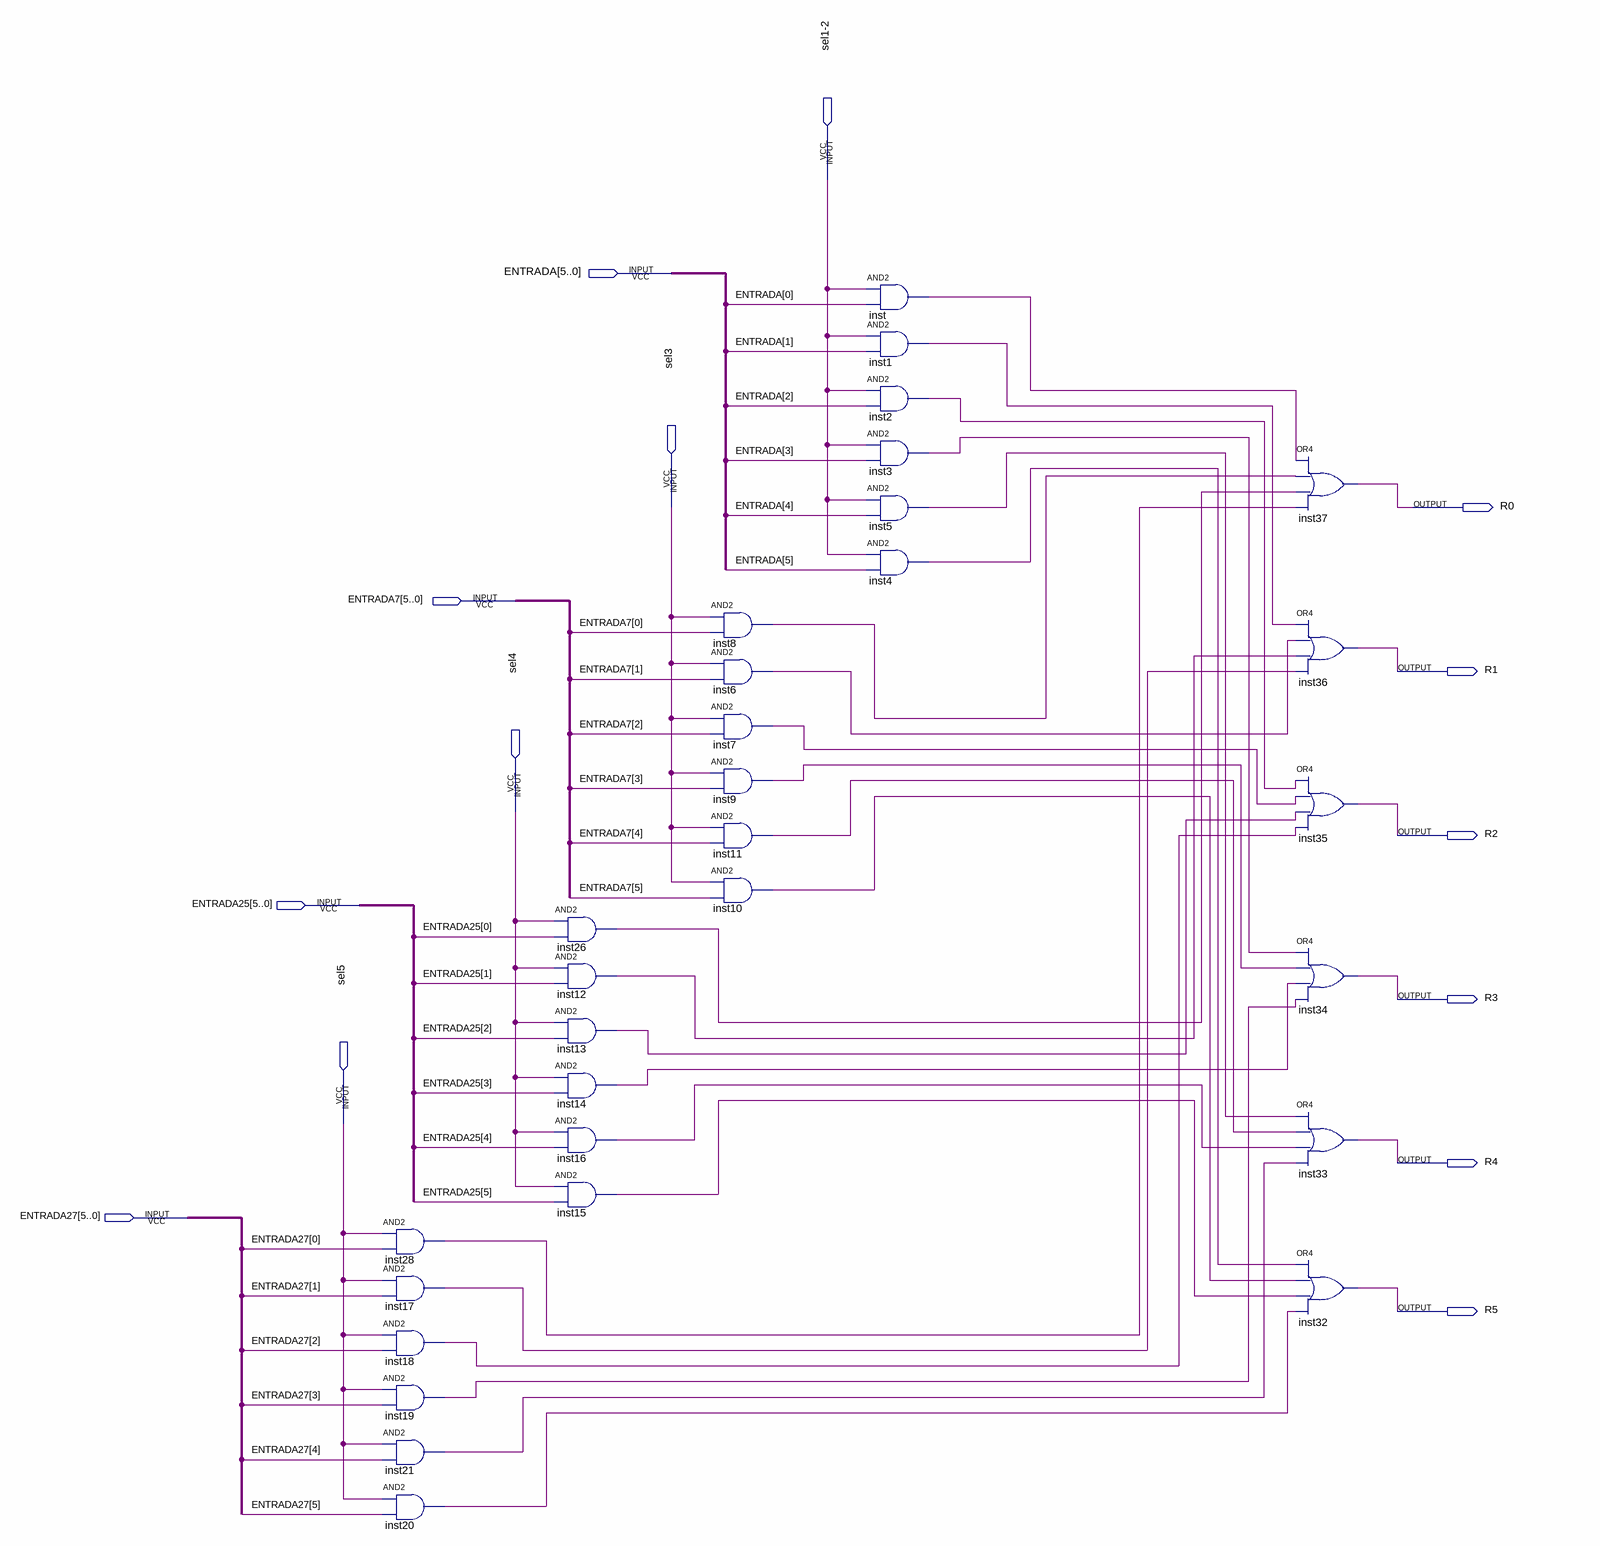
[diagram p0: schematic sheet]
// Quartus schematic OrEntrada.bdf as structural Verilog: 30 symbols, 14 pins
module OrEntrada (
  input  \sel1-2 ,
  input  [5:0] ENTRADA,
  input  sel3,
  input  [5:0] ENTRADA7,
  input  sel4,
  input  [5:0] ENTRADA25,
  input  sel5,
  input  [5:0] ENTRADA27,
  output R0,
  output R1,
  output R2,
  output R3,
  output R4,
  output R5
);

  wire inst1_out, inst2_out, inst3_out, inst4_out, inst5_out, inst6_out, inst7_out, inst8_out, inst9_out,
       inst10_out, inst11_out, inst12_out, inst13_out, inst14_out, inst15_out, inst16_out, inst17_out,
       inst18_out, inst19_out, inst20_out, inst21_out, inst26_out, inst28_out, inst_out;

  and inst28 (inst28_out, sel5, ENTRADA27[0]);
  and inst17 (inst17_out, sel5, ENTRADA27[1]);
  and inst18 (inst18_out, sel5, ENTRADA27[2]);
  and inst19 (inst19_out, sel5, ENTRADA27[3]);
  and inst21 (inst21_out, sel5, ENTRADA27[4]);
  and inst20 (inst20_out, sel5, ENTRADA27[5]);
  and inst26 (inst26_out, sel4, ENTRADA25[0]);
  and inst12 (inst12_out, sel4, ENTRADA25[1]);
  and inst13 (inst13_out, sel4, ENTRADA25[2]);
  and inst14 (inst14_out, sel4, ENTRADA25[3]);
  and inst16 (inst16_out, sel4, ENTRADA25[4]);
  and inst15 (inst15_out, sel4, ENTRADA25[5]);
  and inst8 (inst8_out, sel3, ENTRADA7[0]);
  and inst6 (inst6_out, sel3, ENTRADA7[1]);
  and inst7 (inst7_out, sel3, ENTRADA7[2]);
  and inst9 (inst9_out, sel3, ENTRADA7[3]);
  and inst11 (inst11_out, sel3, ENTRADA7[4]);
  and inst10 (inst10_out, sel3, ENTRADA7[5]);
  and inst (inst_out, \sel1-2 , ENTRADA[0]);
  and inst1 (inst1_out, \sel1-2 , ENTRADA[1]);
  and inst2 (inst2_out, \sel1-2 , ENTRADA[2]);
  and inst3 (inst3_out, \sel1-2 , ENTRADA[3]);
  and inst5 (inst5_out, \sel1-2 , ENTRADA[4]);
  and inst4 (inst4_out, \sel1-2 , ENTRADA[5]);
  or inst37 (R0, inst_out, inst8_out, inst26_out, inst28_out);
  or inst36 (R1, inst1_out, inst6_out, inst12_out, inst17_out);
  or inst35 (R2, inst2_out, inst7_out, inst13_out, inst18_out);
  or inst34 (R3, inst3_out, inst9_out, inst14_out, inst19_out);
  or inst33 (R4, inst5_out, inst11_out, inst16_out, inst21_out);
  or inst32 (R5, inst4_out, inst10_out, inst15_out, inst20_out);
endmodule
